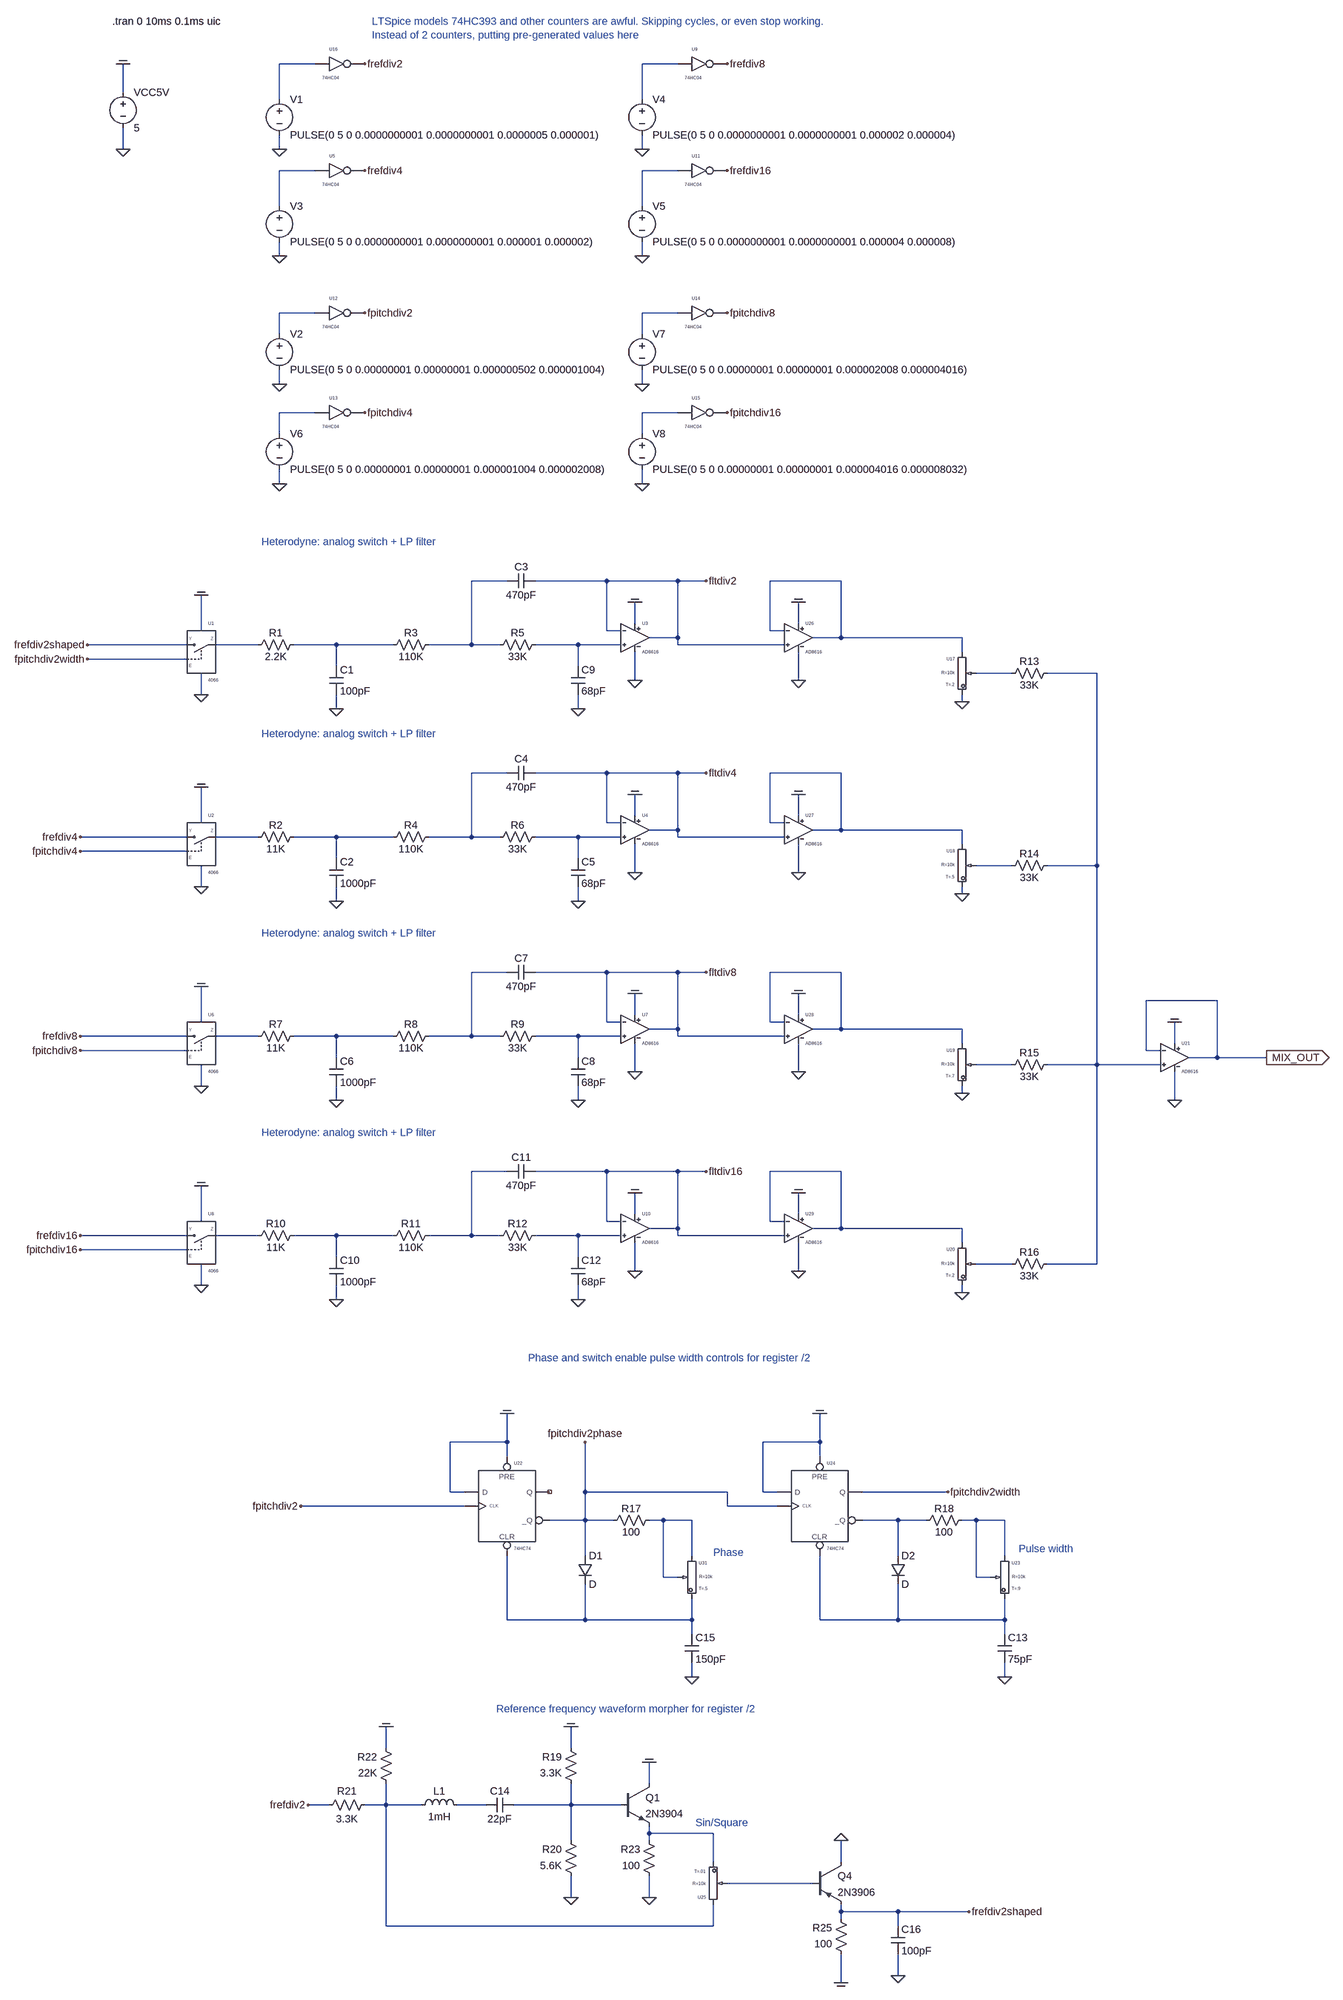
[diagram p0: schematic paradox_mixer_wavetable_v1.asc]
paradox_mixer_wavetable_v1.asc, the LTspice schematic file:
Version 4
SHEET 1 880 3028
WIRE -3904 -1616 -3984 -1616
WIRE -3088 -1616 -3168 -1616
WIRE -4336 -1552 -4336 -1616
WIRE -3984 -1536 -3984 -1616
WIRE -3168 -1536 -3168 -1616
WIRE -4336 -1424 -4336 -1472
WIRE -3984 -1424 -3984 -1456
WIRE -3168 -1424 -3168 -1456
WIRE -3904 -1376 -3984 -1376
WIRE -3088 -1376 -3168 -1376
WIRE -3984 -1296 -3984 -1376
WIRE -3168 -1296 -3168 -1376
WIRE -3984 -1184 -3984 -1216
WIRE -3168 -1184 -3168 -1216
WIRE -3904 -1056 -3984 -1056
WIRE -3088 -1056 -3168 -1056
WIRE -3984 -1008 -3984 -1056
WIRE -3168 -1008 -3168 -1056
WIRE -3984 -896 -3984 -928
WIRE -3168 -896 -3168 -928
WIRE -3904 -832 -3984 -832
WIRE -3088 -832 -3168 -832
WIRE -3984 -784 -3984 -832
WIRE -3168 -784 -3168 -832
WIRE -3984 -672 -3984 -704
WIRE -3168 -672 -3168 -704
WIRE -3472 -272 -3552 -272
WIRE -3248 -272 -3408 -272
WIRE -3088 -272 -3248 -272
WIRE -3024 -272 -3088 -272
WIRE -2720 -272 -2880 -272
WIRE -3184 -176 -3184 -224
WIRE -2816 -176 -2816 -224
WIRE -4160 -160 -4160 -240
WIRE -3248 -160 -3248 -272
WIRE -3216 -160 -3248 -160
WIRE -2880 -160 -2880 -272
WIRE -2848 -160 -2880 -160
WIRE -3088 -144 -3088 -272
WIRE -3088 -144 -3152 -144
WIRE -2720 -144 -2720 -272
WIRE -2720 -144 -2784 -144
WIRE -2448 -144 -2720 -144
WIRE -4192 -128 -4416 -128
WIRE -4032 -128 -4128 -128
WIRE -3856 -128 -3952 -128
WIRE -3728 -128 -3856 -128
WIRE -3552 -128 -3552 -272
WIRE -3552 -128 -3648 -128
WIRE -3488 -128 -3552 -128
WIRE -3312 -128 -3408 -128
WIRE -3216 -128 -3312 -128
WIRE -3088 -128 -3088 -144
WIRE -2848 -128 -3088 -128
WIRE -2448 -112 -2448 -144
WIRE -4192 -96 -4416 -96
WIRE -3856 -80 -3856 -128
WIRE -3312 -80 -3312 -128
WIRE -2336 -64 -2416 -64
WIRE -2144 -64 -2256 -64
WIRE -3184 -48 -3184 -112
WIRE -2816 -48 -2816 -112
WIRE -4160 -16 -4160 -64
WIRE -2448 0 -2448 -16
WIRE -3856 16 -3856 -16
WIRE -3312 16 -3312 -16
WIRE -3472 160 -3552 160
WIRE -3248 160 -3408 160
WIRE -3088 160 -3248 160
WIRE -3024 160 -3088 160
WIRE -2720 160 -2880 160
WIRE -3184 256 -3184 208
WIRE -2816 256 -2816 208
WIRE -4160 272 -4160 192
WIRE -3248 272 -3248 160
WIRE -3216 272 -3248 272
WIRE -2880 272 -2880 160
WIRE -2848 272 -2880 272
WIRE -3088 288 -3088 160
WIRE -3088 288 -3152 288
WIRE -2720 288 -2720 160
WIRE -2720 288 -2784 288
WIRE -2448 288 -2720 288
WIRE -4192 304 -4432 304
WIRE -4032 304 -4128 304
WIRE -3856 304 -3952 304
WIRE -3728 304 -3856 304
WIRE -3552 304 -3552 160
WIRE -3552 304 -3648 304
WIRE -3488 304 -3552 304
WIRE -3312 304 -3408 304
WIRE -3216 304 -3312 304
WIRE -3088 304 -3088 288
WIRE -2848 304 -3088 304
WIRE -2448 320 -2448 288
WIRE -4192 336 -4432 336
WIRE -3856 352 -3856 304
WIRE -3312 352 -3312 304
WIRE -2336 368 -2416 368
WIRE -2144 368 -2144 -64
WIRE -2144 368 -2256 368
WIRE -3184 384 -3184 320
WIRE -2816 384 -2816 320
WIRE -4160 416 -4160 368
WIRE -2448 432 -2448 416
WIRE -3856 448 -3856 416
WIRE -3312 448 -3312 416
WIRE -3472 608 -3552 608
WIRE -3248 608 -3408 608
WIRE -3088 608 -3248 608
WIRE -3024 608 -3088 608
WIRE -2720 608 -2880 608
WIRE -1760 672 -1920 672
WIRE -3184 704 -3184 656
WIRE -2816 704 -2816 656
WIRE -4160 720 -4160 640
WIRE -3248 720 -3248 608
WIRE -3216 720 -3248 720
WIRE -2880 720 -2880 608
WIRE -2848 720 -2880 720
WIRE -3088 736 -3088 608
WIRE -3088 736 -3152 736
WIRE -2720 736 -2720 608
WIRE -2720 736 -2784 736
WIRE -2448 736 -2720 736
WIRE -4192 752 -4432 752
WIRE -4032 752 -4128 752
WIRE -3856 752 -3952 752
WIRE -3728 752 -3856 752
WIRE -3552 752 -3552 608
WIRE -3552 752 -3648 752
WIRE -3488 752 -3552 752
WIRE -3312 752 -3408 752
WIRE -3216 752 -3312 752
WIRE -3088 752 -3088 736
WIRE -2848 752 -3088 752
WIRE -2448 768 -2448 736
WIRE -1856 768 -1856 720
WIRE -4192 784 -4432 784
WIRE -1920 784 -1920 672
WIRE -1888 784 -1920 784
WIRE -3856 800 -3856 752
WIRE -3312 800 -3312 752
WIRE -1760 800 -1760 672
WIRE -1760 800 -1824 800
WIRE -1648 800 -1760 800
WIRE -2336 816 -2416 816
WIRE -2144 816 -2144 368
WIRE -2144 816 -2256 816
WIRE -1888 816 -2144 816
WIRE -3184 832 -3184 768
WIRE -2816 832 -2816 768
WIRE -4160 864 -4160 816
WIRE -2448 880 -2448 864
WIRE -3856 896 -3856 864
WIRE -3312 896 -3312 864
WIRE -1856 896 -1856 832
WIRE -3472 1056 -3552 1056
WIRE -3248 1056 -3408 1056
WIRE -3088 1056 -3248 1056
WIRE -3024 1056 -3088 1056
WIRE -2720 1056 -2880 1056
WIRE -3184 1152 -3184 1104
WIRE -2816 1152 -2816 1104
WIRE -4160 1168 -4160 1088
WIRE -3248 1168 -3248 1056
WIRE -3216 1168 -3248 1168
WIRE -2880 1168 -2880 1056
WIRE -2848 1168 -2880 1168
WIRE -3088 1184 -3088 1056
WIRE -3088 1184 -3152 1184
WIRE -2720 1184 -2720 1056
WIRE -2720 1184 -2784 1184
WIRE -2448 1184 -2720 1184
WIRE -4192 1200 -4432 1200
WIRE -4032 1200 -4128 1200
WIRE -3856 1200 -3952 1200
WIRE -3728 1200 -3856 1200
WIRE -3552 1200 -3552 1056
WIRE -3552 1200 -3648 1200
WIRE -3488 1200 -3552 1200
WIRE -3312 1200 -3408 1200
WIRE -3216 1200 -3312 1200
WIRE -3088 1200 -3088 1184
WIRE -2848 1200 -3088 1200
WIRE -2448 1216 -2448 1184
WIRE -4192 1232 -4432 1232
WIRE -3856 1248 -3856 1200
WIRE -3312 1248 -3312 1200
WIRE -2336 1264 -2416 1264
WIRE -2144 1264 -2144 816
WIRE -2144 1264 -2256 1264
WIRE -3184 1280 -3184 1216
WIRE -2816 1280 -2816 1216
WIRE -4160 1312 -4160 1264
WIRE -2448 1328 -2448 1312
WIRE -3856 1344 -3856 1312
WIRE -3312 1344 -3312 1312
WIRE -3472 1776 -3472 1712
WIRE -3472 1776 -3600 1776
WIRE -2768 1776 -2768 1712
WIRE -2768 1776 -2896 1776
WIRE -3472 1808 -3472 1776
WIRE -2768 1808 -2768 1776
WIRE -3600 1888 -3600 1776
WIRE -3568 1888 -3600 1888
WIRE -3296 1888 -3296 1776
WIRE -2976 1888 -3296 1888
WIRE -2896 1888 -2896 1776
WIRE -2864 1888 -2896 1888
WIRE -2480 1888 -2672 1888
WIRE -3568 1920 -3936 1920
WIRE -2976 1920 -2976 1888
WIRE -2864 1920 -2976 1920
WIRE -3296 1952 -3296 1888
WIRE -3296 1952 -3376 1952
WIRE -3232 1952 -3296 1952
WIRE -3120 1952 -3152 1952
WIRE -3056 1952 -3120 1952
WIRE -2592 1952 -2672 1952
WIRE -2528 1952 -2592 1952
WIRE -2416 1952 -2448 1952
WIRE -2352 1952 -2416 1952
WIRE -3296 2032 -3296 1952
WIRE -3056 2032 -3056 1952
WIRE -2592 2032 -2592 1952
WIRE -2352 2032 -2352 1952
WIRE -3120 2080 -3120 1952
WIRE -3088 2080 -3120 2080
WIRE -2416 2080 -2416 1952
WIRE -2384 2080 -2416 2080
WIRE -3472 2176 -3472 2032
WIRE -3296 2176 -3296 2096
WIRE -3296 2176 -3472 2176
WIRE -3056 2176 -3056 2128
WIRE -3056 2176 -3296 2176
WIRE -2768 2176 -2768 2032
WIRE -2592 2176 -2592 2096
WIRE -2592 2176 -2768 2176
WIRE -2352 2176 -2352 2128
WIRE -2352 2176 -2592 2176
WIRE -3056 2208 -3056 2176
WIRE -2352 2208 -2352 2176
WIRE -3056 2304 -3056 2272
WIRE -2352 2304 -2352 2272
WIRE -3744 2464 -3744 2416
WIRE -3328 2464 -3328 2416
WIRE -3152 2544 -3152 2496
WIRE -3872 2592 -3920 2592
WIRE -3744 2592 -3744 2544
WIRE -3744 2592 -3792 2592
WIRE -3664 2592 -3744 2592
WIRE -3520 2592 -3584 2592
WIRE -3328 2592 -3328 2544
WIRE -3328 2592 -3456 2592
WIRE -3216 2592 -3328 2592
WIRE -3152 2656 -3152 2640
WIRE -3008 2656 -3152 2656
WIRE -3328 2672 -3328 2592
WIRE -3152 2672 -3152 2656
WIRE -3008 2720 -3008 2656
WIRE -2720 2720 -2720 2672
WIRE -2784 2768 -2976 2768
WIRE -3328 2800 -3328 2752
WIRE -3152 2800 -3152 2752
WIRE -2720 2832 -2720 2816
WIRE -2592 2832 -2720 2832
WIRE -2432 2832 -2592 2832
WIRE -2720 2848 -2720 2832
WIRE -3744 2864 -3744 2592
WIRE -3008 2864 -3008 2816
WIRE -3008 2864 -3744 2864
WIRE -2592 2864 -2592 2832
WIRE -2592 2976 -2592 2928
WIRE -2720 2992 -2720 2928
FLAG -4336 -1616 COM
FLAG -4336 -1424 0
FLAG -3984 -1424 0
FLAG -3984 -896 0
FLAG -3856 16 0
FLAG -3792 -1616 frefdiv2
FLAG -4416 -96 fpitchdiv2width
FLAG -4160 -240 COM
FLAG -4160 -16 0
FLAG -3184 -48 0
FLAG -3184 -224 COM
FLAG -3024 -272 fltdiv2
FLAG -4416 -128 frefdiv2shaped
FLAG -3312 16 0
FLAG -4432 336 fpitchdiv4
FLAG -4160 192 COM
FLAG -4160 416 0
FLAG -3184 384 0
FLAG -3184 208 COM
FLAG -3024 160 fltdiv4
FLAG -4432 304 frefdiv4
FLAG -4432 784 fpitchdiv8
FLAG -4160 640 COM
FLAG -4160 864 0
FLAG -3184 832 0
FLAG -3184 656 COM
FLAG -3024 608 fltdiv8
FLAG -4432 752 frefdiv8
FLAG -4432 1232 fpitchdiv16
FLAG -4160 1088 COM
FLAG -4160 1312 0
FLAG -3184 1280 0
FLAG -3184 1104 COM
FLAG -3024 1056 fltdiv16
FLAG -4432 1200 frefdiv16
FLAG -3984 -1184 0
FLAG -3792 -1376 frefdiv4
FLAG -3168 -1424 0
FLAG -2976 -1616 frefdiv8
FLAG -3168 -1184 0
FLAG -2976 -1376 frefdiv16
FLAG -3792 -1056 fpitchdiv2
FLAG -3984 -672 0
FLAG -3792 -832 fpitchdiv4
FLAG -3168 -896 0
FLAG -2976 -1056 fpitchdiv8
FLAG -3168 -672 0
FLAG -2976 -832 fpitchdiv16
FLAG -3856 448 0
FLAG -3312 448 0
FLAG -3856 896 0
FLAG -3312 896 0
FLAG -3856 1344 0
FLAG -3312 1344 0
FLAG -2448 0 0
FLAG -2448 432 0
FLAG -2448 880 0
FLAG -2448 1328 0
FLAG -1856 896 0
FLAG -1856 720 COM
FLAG -1648 800 MIX_OUT
IOPIN -1648 800 Out
FLAG -3936 1920 fpitchdiv2
FLAG -3296 1776 fpitchdiv2phase
FLAG -2816 -48 0
FLAG -2816 -224 COM
FLAG -2816 384 0
FLAG -2816 208 COM
FLAG -2816 832 0
FLAG -2816 656 COM
FLAG -2816 1280 0
FLAG -2816 1104 COM
FLAG -3056 2304 0
FLAG -3472 1712 COM
FLAG -2480 1888 fpitchdiv2width
FLAG -2352 2304 0
FLAG -2768 1712 COM
FLAG -3920 2592 frefdiv2
FLAG -3328 2800 0
FLAG -3328 2416 COM
FLAG -3152 2800 0
FLAG -3152 2496 COM
FLAG -2720 2672 0
FLAG -2720 2992 COM
FLAG -2432 2832 frefdiv2shaped
FLAG -3744 2416 COM
FLAG -2592 2976 0
SYMBOL voltage -4336 -1568 R0
WINDOW 123 0 0 Left 2
WINDOW 39 0 0 Left 2
SYMATTR InstName VCC5V
SYMATTR Value 5
SYMBOL voltage -3984 -1552 R0
WINDOW 123 0 0 Left 2
WINDOW 39 0 0 Left 2
SYMATTR InstName V1
SYMATTR Value PULSE(0 5 0 0.0000000001 0.0000000001 0.0000005 0.000001)
SYMBOL voltage -3984 -1024 R0
WINDOW 123 0 0 Left 2
WINDOW 39 0 0 Left 2
SYMATTR InstName V2
SYMATTR Value PULSE(0 5 0 0.00000001 0.00000001 0.000000502 0.000001004)
SYMBOL res -4048 -112 R270
WINDOW 0 27 56 VTop 2
WINDOW 3 5 56 VBottom 2
SYMATTR InstName R1
SYMATTR Value 2.2K
SYMBOL cap -3872 -80 R0
SYMATTR InstName C1
SYMATTR Value 100pF
SYMBOL res -3632 -144 R90
WINDOW 0 5 56 VBottom 2
WINDOW 3 27 56 VTop 2
SYMATTR InstName R3
SYMATTR Value 110K
SYMBOL cap -3408 -288 R90
WINDOW 0 0 32 VBottom 2
WINDOW 3 32 32 VTop 2
SYMATTR InstName C3
SYMATTR Value 470pF
SYMBOL cd4066 -4160 -112 R0
SYMATTR InstName U1
SYMBOL AD8616 -3184 -144 R0
SYMATTR InstName U3
SYMBOL res -3392 -144 R90
WINDOW 0 5 56 VBottom 2
WINDOW 3 27 56 VTop 2
SYMATTR InstName R5
SYMATTR Value 33K
SYMBOL cap -3328 -80 R0
SYMATTR InstName C9
SYMATTR Value 68pF
SYMBOL cd4066 -4160 320 R0
SYMATTR InstName U2
SYMBOL AD8616 -3184 288 R0
SYMATTR InstName U4
SYMBOL cd4066 -4160 768 R0
SYMATTR InstName U6
SYMBOL AD8616 -3184 736 R0
SYMATTR InstName U7
SYMBOL cd4066 -4160 1216 R0
SYMATTR InstName U8
SYMBOL AD8616 -3184 1184 R0
SYMATTR InstName U10
SYMBOL 74hc04 -3856 -1680 R0
SYMATTR InstName U16
SYMBOL voltage -3984 -1312 R0
WINDOW 123 0 0 Left 2
WINDOW 39 0 0 Left 2
SYMATTR InstName V3
SYMATTR Value PULSE(0 5 0 0.0000000001 0.0000000001 0.000001 0.000002)
SYMBOL 74hc04 -3856 -1440 R0
SYMATTR InstName U5
SYMBOL voltage -3168 -1552 R0
WINDOW 123 0 0 Left 2
WINDOW 39 0 0 Left 2
SYMATTR InstName V4
SYMATTR Value PULSE(0 5 0 0.0000000001 0.0000000001 0.000002 0.000004)
SYMBOL 74hc04 -3040 -1680 R0
SYMATTR InstName U9
SYMBOL voltage -3168 -1312 R0
WINDOW 123 0 0 Left 2
WINDOW 39 0 0 Left 2
SYMATTR InstName V5
SYMATTR Value PULSE(0 5 0 0.0000000001 0.0000000001 0.000004 0.000008)
SYMBOL 74hc04 -3040 -1440 R0
SYMATTR InstName U11
SYMBOL 74hc04 -3856 -1120 R0
SYMATTR InstName U12
SYMBOL voltage -3984 -800 R0
WINDOW 123 0 0 Left 2
WINDOW 39 0 0 Left 2
SYMATTR InstName V6
SYMATTR Value PULSE(0 5 0 0.00000001 0.00000001 0.000001004 0.000002008)
SYMBOL 74hc04 -3856 -896 R0
SYMATTR InstName U13
SYMBOL voltage -3168 -1024 R0
WINDOW 123 0 0 Left 2
WINDOW 39 0 0 Left 2
SYMATTR InstName V7
SYMATTR Value PULSE(0 5 0 0.00000001 0.00000001 0.000002008 0.000004016)
SYMBOL 74hc04 -3040 -1120 R0
SYMATTR InstName U14
SYMBOL voltage -3168 -800 R0
WINDOW 123 0 0 Left 2
WINDOW 39 0 0 Left 2
SYMATTR InstName V8
SYMATTR Value PULSE(0 5 0 0.00000001 0.00000001 0.000004016 0.000008032)
SYMBOL 74hc04 -3040 -896 R0
SYMATTR InstName U15
SYMBOL res -4048 320 R270
WINDOW 0 27 56 VTop 2
WINDOW 3 5 56 VBottom 2
SYMATTR InstName R2
SYMATTR Value 11K
SYMBOL cap -3872 352 R0
SYMATTR InstName C2
SYMATTR Value 1000pF
SYMBOL res -3632 288 R90
WINDOW 0 5 56 VBottom 2
WINDOW 3 27 56 VTop 2
SYMATTR InstName R4
SYMATTR Value 110K
SYMBOL cap -3408 144 R90
WINDOW 0 0 32 VBottom 2
WINDOW 3 32 32 VTop 2
SYMATTR InstName C4
SYMATTR Value 470pF
SYMBOL res -3392 288 R90
WINDOW 0 5 56 VBottom 2
WINDOW 3 27 56 VTop 2
SYMATTR InstName R6
SYMATTR Value 33K
SYMBOL cap -3328 352 R0
SYMATTR InstName C5
SYMATTR Value 68pF
SYMBOL res -4048 768 R270
WINDOW 0 27 56 VTop 2
WINDOW 3 5 56 VBottom 2
SYMATTR InstName R7
SYMATTR Value 11K
SYMBOL cap -3872 800 R0
SYMATTR InstName C6
SYMATTR Value 1000pF
SYMBOL res -3632 736 R90
WINDOW 0 5 56 VBottom 2
WINDOW 3 27 56 VTop 2
SYMATTR InstName R8
SYMATTR Value 110K
SYMBOL cap -3408 592 R90
WINDOW 0 0 32 VBottom 2
WINDOW 3 32 32 VTop 2
SYMATTR InstName C7
SYMATTR Value 470pF
SYMBOL res -3392 736 R90
WINDOW 0 5 56 VBottom 2
WINDOW 3 27 56 VTop 2
SYMATTR InstName R9
SYMATTR Value 33K
SYMBOL cap -3328 800 R0
SYMATTR InstName C8
SYMATTR Value 68pF
SYMBOL res -4048 1216 R270
WINDOW 0 27 56 VTop 2
WINDOW 3 5 56 VBottom 2
SYMATTR InstName R10
SYMATTR Value 11K
SYMBOL cap -3872 1248 R0
SYMATTR InstName C10
SYMATTR Value 1000pF
SYMBOL res -3632 1184 R90
WINDOW 0 5 56 VBottom 2
WINDOW 3 27 56 VTop 2
SYMATTR InstName R11
SYMATTR Value 110K
SYMBOL cap -3408 1040 R90
WINDOW 0 0 32 VBottom 2
WINDOW 3 32 32 VTop 2
SYMATTR InstName C11
SYMATTR Value 470pF
SYMBOL res -3392 1184 R90
WINDOW 0 5 56 VBottom 2
WINDOW 3 27 56 VTop 2
SYMATTR InstName R12
SYMATTR Value 33K
SYMBOL cap -3328 1248 R0
SYMATTR InstName C12
SYMATTR Value 68pF
SYMBOL pot -2448 -64 M0
SYMATTR InstName U17
SYMATTR Value2 T=.2
SYMBOL pot -2448 368 M0
SYMATTR InstName U18
SYMBOL pot -2448 816 M0
SYMATTR InstName U19
SYMATTR Value2 T=.7
SYMBOL pot -2448 1264 M0
SYMATTR InstName U20
SYMATTR Value2 T=.2
SYMBOL res -2240 -80 R90
WINDOW 0 5 56 VBottom 2
WINDOW 3 27 56 VTop 2
SYMATTR InstName R13
SYMATTR Value 33K
SYMBOL res -2240 352 R90
WINDOW 0 5 56 VBottom 2
WINDOW 3 27 56 VTop 2
SYMATTR InstName R14
SYMATTR Value 33K
SYMBOL res -2240 800 R90
WINDOW 0 5 56 VBottom 2
WINDOW 3 27 56 VTop 2
SYMATTR InstName R15
SYMATTR Value 33K
SYMBOL res -2240 1248 R90
WINDOW 0 5 56 VBottom 2
WINDOW 3 27 56 VTop 2
SYMATTR InstName R16
SYMATTR Value 33K
SYMBOL AD8616 -1856 800 R0
SYMATTR InstName U21
SYMBOL AD8616 -2816 -144 R0
SYMATTR InstName U26
SYMBOL AD8616 -2816 288 R0
SYMATTR InstName U27
SYMBOL AD8616 -2816 736 R0
SYMATTR InstName U28
SYMBOL AD8616 -2816 1184 R0
SYMATTR InstName U29
SYMBOL pot -3056 2080 R0
SYMATTR InstName U31
SYMBOL cap -3072 2208 R0
SYMATTR InstName C15
SYMATTR Value 150pF
SYMBOL 74hc74 -3472 1808 R0
SYMATTR InstName U22
SYMBOL res -3136 1936 R90
WINDOW 0 5 56 VBottom 2
WINDOW 3 27 56 VTop 2
SYMATTR InstName R17
SYMATTR Value 100
SYMBOL diode -3312 2032 R0
SYMATTR InstName D1
SYMBOL pot -2352 2080 R0
SYMATTR InstName U23
SYMATTR Value2 T=.9
SYMBOL cap -2368 2208 R0
SYMATTR InstName C13
SYMATTR Value 75pF
SYMBOL 74hc74 -2768 1808 R0
SYMATTR InstName U24
SYMBOL res -2432 1936 R90
WINDOW 0 5 56 VBottom 2
WINDOW 3 27 56 VTop 2
SYMATTR InstName R18
SYMATTR Value 100
SYMBOL diode -2608 2032 R0
SYMATTR InstName D2
SYMBOL ind -3568 2608 M270
WINDOW 0 32 56 VTop 2
WINDOW 3 5 56 VBottom 2
SYMATTR InstName L1
SYMATTR Value 1mH
SYMBOL cap -3456 2576 R90
WINDOW 0 0 32 VBottom 2
WINDOW 3 32 32 VTop 2
SYMATTR InstName C14
SYMATTR Value 22pF
SYMBOL res -3312 2560 R180
WINDOW 0 36 76 Left 2
WINDOW 3 36 40 Left 2
SYMATTR InstName R19
SYMATTR Value 3.3K
SYMBOL res -3312 2768 R180
WINDOW 0 36 76 Left 2
WINDOW 3 36 40 Left 2
SYMATTR InstName R20
SYMATTR Value 5.6K
SYMBOL res -3888 2608 R270
WINDOW 0 32 56 VTop 2
WINDOW 3 0 56 VBottom 2
SYMATTR InstName R21
SYMATTR Value 3.3K
SYMBOL npn -3216 2544 R0
SYMATTR InstName Q1
SYMATTR Value 2N3904
SYMBOL res -3136 2768 R180
WINDOW 0 36 76 Left 2
WINDOW 3 36 40 Left 2
SYMATTR InstName R23
SYMATTR Value 100
SYMBOL pot -3008 2768 R180
SYMATTR InstName U25
SYMATTR Value2 T=.01
SYMBOL res -2704 2944 R180
WINDOW 0 36 76 Left 2
WINDOW 3 36 40 Left 2
SYMATTR InstName R25
SYMATTR Value 100
SYMBOL pnp -2784 2720 R0
SYMATTR InstName Q4
SYMATTR Value 2N3906
SYMBOL res -3728 2560 R180
WINDOW 0 36 76 Left 2
WINDOW 3 36 40 Left 2
SYMATTR InstName R22
SYMATTR Value 22K
SYMBOL cap -2608 2864 R0
SYMATTR InstName C16
SYMATTR Value 100pF
TEXT -4360 -1712 Left 2 !.tran 0 10ms 0.1ms uic
TEXT -4024 -360 Left 2 ;Heterodyne: analog switch + LP filter
TEXT -4024 72 Left 2 ;Heterodyne: analog switch + LP filter
TEXT -4024 520 Left 2 ;Heterodyne: analog switch + LP filter
TEXT -4024 968 Left 2 ;Heterodyne: analog switch + LP filter
TEXT -3776 -1712 Left 2 ;LTSpice models 74HC393 and other counters are awful. Skipping cycles, or even stop working.\nInstead of 2 counters, putting pre-generated values here
TEXT -3008 2024 Left 2 ;Phase
TEXT -2320 2016 Left 2 ;Pulse width
TEXT -3424 1552 Left 2 ;Phase and switch enable pulse width controls for register /2
TEXT -3496 2376 Left 2 ;Reference frequency waveform morpher for register /2
TEXT -3048 2632 Left 2 ;Sin/Square

The netlist it stands for:
* paradox_mixer_wavetable_v1.asc
VCC5V COM 0 5
V1 N001 0 PULSE(0 5 0 0.0000000001 0.0000000001 0.0000005 0.000001)
V2 N005 0 PULSE(0 5 0 0.00000001 0.00000001 0.000000502 0.000001004)
R1 N011 N012 2.2K
C1 N012 0 100pF
R3 N009 N012 110K
C3 fltdiv2 N009 470pF
XU1 frefdiv2shaped N011 fpitchdiv2width COM 0 4066  ; pins Y OUT EN VCC VSS
XU3 N013 fltdiv2 COM 0 fltdiv2 AD8616  ; pins In+ In- V+ V- OUT
R5 N013 N009 33K
C9 N013 0 68pF
XU2 frefdiv4 N018 fpitchdiv4 COM 0 4066  ; pins Y OUT EN VCC VSS
XU4 N020 fltdiv4 COM 0 fltdiv4 AD8616  ; pins In+ In- V+ V- OUT
XU6 frefdiv8 N024 fpitchdiv8 COM 0 4066  ; pins Y OUT EN VCC VSS
XU7 N026 fltdiv8 COM 0 fltdiv8 AD8616  ; pins In+ In- V+ V- OUT
XU8 frefdiv16 N030 fpitchdiv16 COM 0 4066  ; pins Y OUT EN VCC VSS
XU10 N032 fltdiv16 COM 0 fltdiv16 AD8616  ; pins In+ In- V+ V- OUT
XU16 N001 frefdiv2 VCC 0 74HC04 VCC=5  SPEED=1.0  TRIPDT=1e-9  ; pins A Y
V3 N003 0 PULSE(0 5 0 0.0000000001 0.0000000001 0.000001 0.000002)
XU5 N003 frefdiv4 VCC 0 74HC04 VCC=5  SPEED=1.0  TRIPDT=1e-9  ; pins A Y
V4 N002 0 PULSE(0 5 0 0.0000000001 0.0000000001 0.000002 0.000004)
XU9 N002 frefdiv8 VCC 0 74HC04 VCC=5  SPEED=1.0  TRIPDT=1e-9  ; pins A Y
V5 N004 0 PULSE(0 5 0 0.0000000001 0.0000000001 0.000004 0.000008)
XU11 N004 frefdiv16 VCC 0 74HC04 VCC=5  SPEED=1.0  TRIPDT=1e-9  ; pins A Y
XU12 N005 fpitchdiv2 VCC 0 74HC04 VCC=5  SPEED=1.0  TRIPDT=1e-9  ; pins A Y
V6 N007 0 PULSE(0 5 0 0.00000001 0.00000001 0.000001004 0.000002008)
XU13 N007 fpitchdiv4 VCC 0 74HC04 VCC=5  SPEED=1.0  TRIPDT=1e-9  ; pins A Y
V7 N006 0 PULSE(0 5 0 0.00000001 0.00000001 0.000002008 0.000004016)
XU14 N006 fpitchdiv8 VCC 0 74HC04 VCC=5  SPEED=1.0  TRIPDT=1e-9  ; pins A Y
V8 N008 0 PULSE(0 5 0 0.00000001 0.00000001 0.000004016 0.000008032)
XU15 N008 fpitchdiv16 VCC 0 74HC04 VCC=5  SPEED=1.0  TRIPDT=1e-9  ; pins A Y
R2 N018 N019 11K
C2 N019 0 1000pF
R4 N016 N019 110K
C4 fltdiv4 N016 470pF
R6 N020 N016 33K
C5 N020 0 68pF
R7 N024 N025 11K
C6 N025 0 1000pF
R8 N022 N025 110K
C7 fltdiv8 N022 470pF
R9 N026 N022 33K
C8 N026 0 68pF
R10 N030 N031 11K
C10 N031 0 1000pF
R11 N028 N031 110K
C11 fltdiv16 N028 470pF
R12 N032 N028 33K
C12 N032 0 68pF
XU17 N010 0 N014 pot R=10k T=.2  ; pins A B C
XU18 N017 0 N021 pot R=10k T=.5  ; pins A B C
XU19 N023 0 N027 pot R=10k T=.7  ; pins A B C
XU20 N029 0 N033 pot R=10k T=.2  ; pins A B C
R13 N015 N014 33K
R14 N015 N021 33K
R15 N015 N027 33K
R16 N015 N033 33K
XU21 N015 MIX_OUT COM 0 MIX_OUT AD8616  ; pins In+ In- V+ V- OUT
XU26 fltdiv2 N010 COM 0 N010 AD8616  ; pins In+ In- V+ V- OUT
XU27 fltdiv4 N017 COM 0 N017 AD8616  ; pins In+ In- V+ V- OUT
XU28 fltdiv8 N023 COM 0 N023 AD8616  ; pins In+ In- V+ V- OUT
XU29 fltdiv16 N029 COM 0 N029 AD8616  ; pins In+ In- V+ V- OUT
XU31 N034 N037 N034 pot R=10k T=.5  ; pins A B C
C15 N037 0 150pF
XU22 COM fpitchdiv2 COM N037 NC_01 fpitchdiv2phase VCC 0 74HC74 VCC=5  SPEED=1.0  TRIPDT=1e-9  ; pins PRE CP D CLR Q _Q
R17 N034 fpitchdiv2phase 100
D1 fpitchdiv2phase N037 D
XU23 N036 N038 N036 pot R=10k T=.9  ; pins A B C
C13 N038 0 75pF
XU24 COM fpitchdiv2phase COM N038 fpitchdiv2width N035 VCC 0 74HC74 VCC=5  SPEED=1.0  TRIPDT=1e-9  ; pins PRE CP D CLR Q _Q
R18 N036 N035 100
D2 N035 N038 D
L1 N040 N039 1mH
C14 N041 N040 22pF
R19 N041 COM 3.3K
R20 0 N041 5.6K
R21 frefdiv2 N039 3.3K
Q1 COM N041 N042 0 2N3904
R23 0 N042 100
XU25 N039 N042 N043 pot R=10k T=.01  ; pins A B C
R25 COM frefdiv2shaped 100
Q4 0 N043 frefdiv2shaped 0 2N3906
R22 N039 COM 22K
C16 frefdiv2shaped 0 100pF
.model D D
.lib standard.dio
.model NPN NPN
.model PNP PNP
.lib standard.bjt
.tran 0 10ms 0.1ms uic
* Heterodyne: analog switch + LP filter
* Heterodyne: analog switch + LP filter
* Heterodyne: analog switch + LP filter
* Heterodyne: analog switch + LP filter
* LTSpice models 74HC393 and other counters are awful. Skipping cycles, or even stop working.
* Instead of 2 counters, putting pre-generated values here
* Phase
* Pulse width
* Phase and switch enable pulse width controls for register /2
* Reference frequency waveform morpher for register /2
* Sin/Square
.lib SwitchAna.lib
.lib AD8616.cir
.lib 74HC.lib
.lib pot.lib
.backanno
.end